# EAGLE design ACSN v2a (EAGLE 9.6.2)
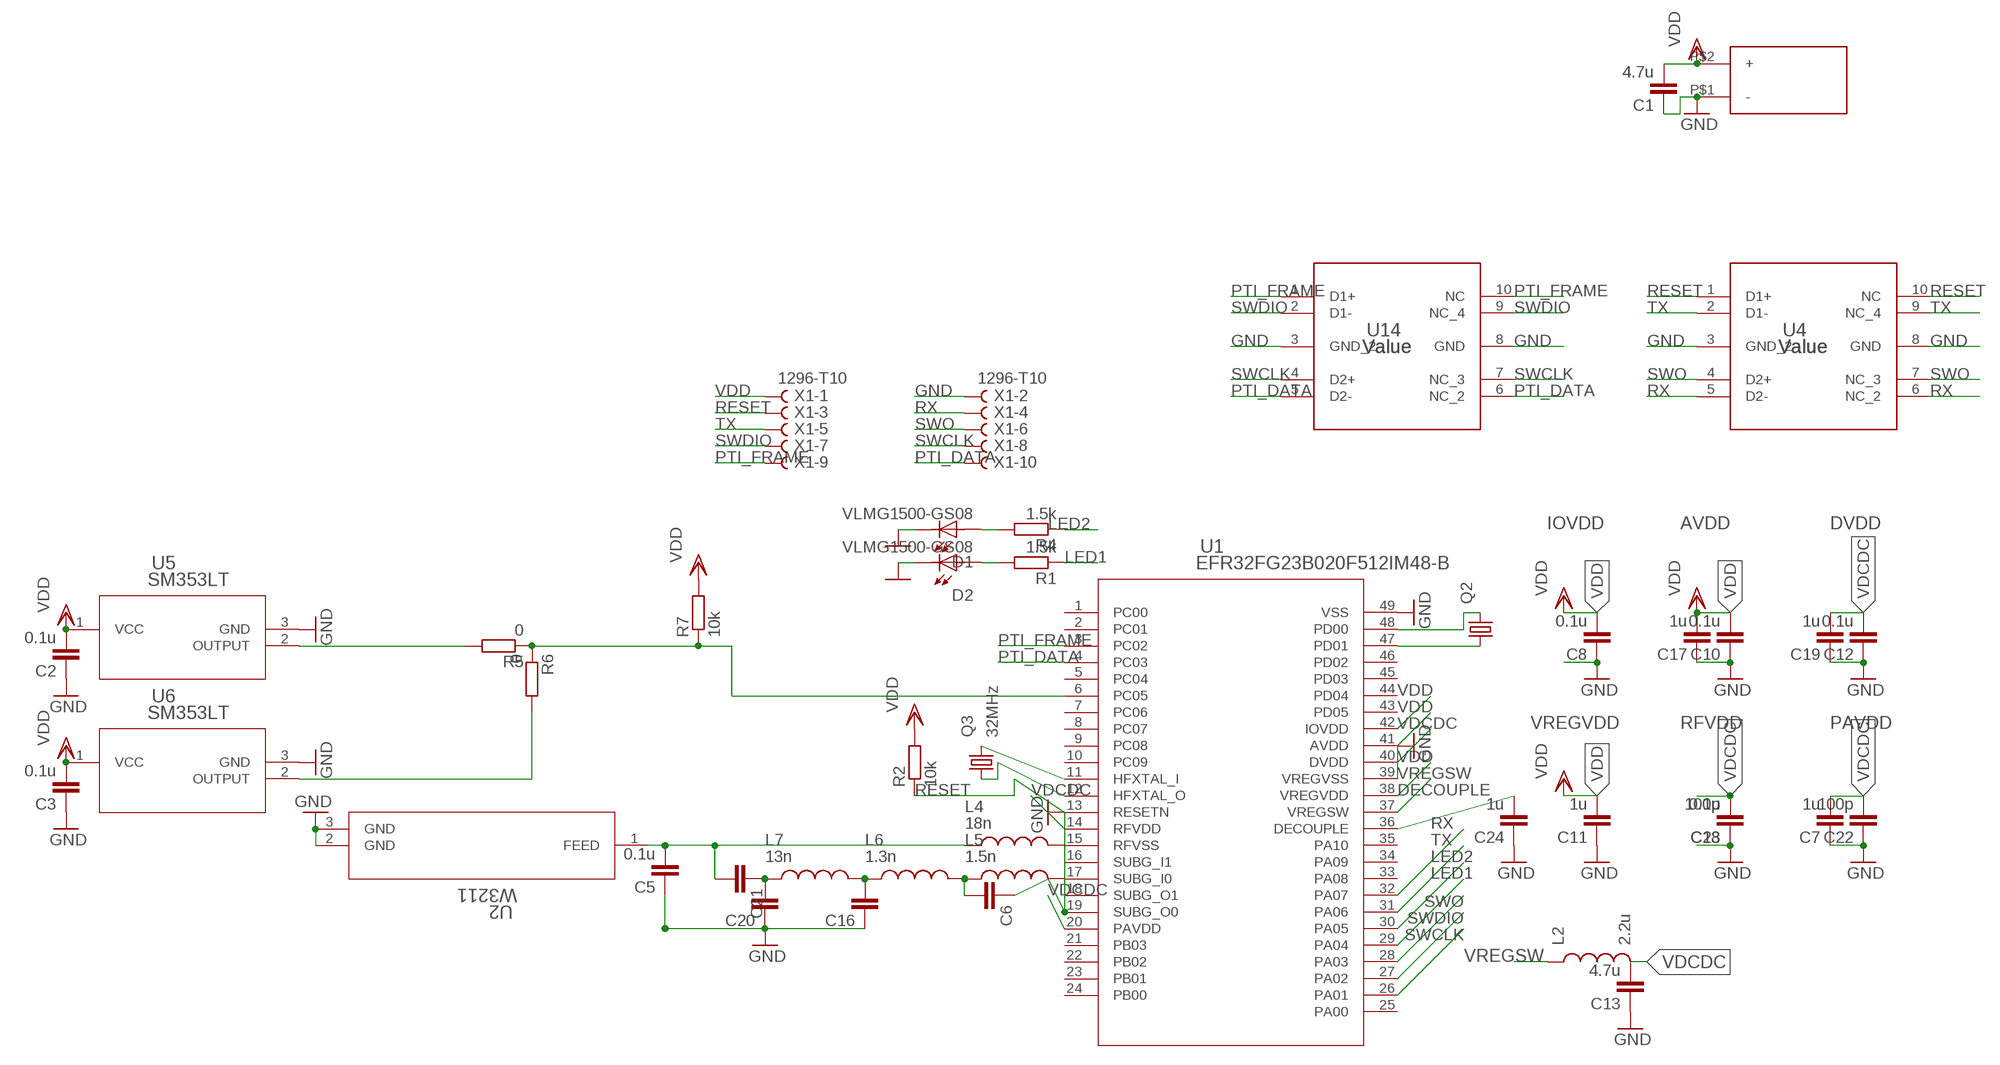
[diagram p0: schematic, sheet 1]

## Parts
C1  4.7u  CC0603R  [C0603R]
C2  0.1u  CC0402  [C0402]
C3  0.1u  CC0402  [C0402]
C5  0.1u  CC0402  [C0402]
C6  1.9p  CC0402  [C0402]
C7  1u  CC0402  [C0402]
C8  0.1u  CC0402  [C0402]
C10  0.1u  CC0402  [C0402]
C11  1u  CC0402  [C0402]
C12  0.1u  CC0402  [C0402]
C13  4.7u  CC0603R  [C0603R]
C16  7.2p  CC0402  [C0402]
C17  1u  CC0402  [C0402]
C18  0.1u  CC0402  [C0402]
C19  1u  CC0402  [C0402]
C20  1.3p  CC0402  [C0402]
C21  220p  CC0402  [C0402]
C22  100p  CC0402  [C0402]
C23  100p  CC0402  [C0402]
C24  1u  CC0402  [C0402]
D1  VLMG1500-GS08  [LEDC1005X35N]
D2  VLMG1500-GS08  [LEDC1005X35N]
L2  2.2u  INDUCTOR  [L0603]
L4  18n  MHQ0402P7N5JT000  [INDC0402X26N]
L5  1.5n  MHQ0402P7N5JT000  [INDC0402X26N]
L6  1.3n  MHQ0402P7N5JT000  [INDC0402X26N]
L7  13n  MHQ0402P7N5JT000  [INDC0402X26N]
Q2  KX-327-RT  [2.0X1.2]
Q3  32MHz  KX-5  [2.0X1.6_KX-5]
R1  1.5k  RR0402  [R0402]
R2  10k  RR0402  [R0402]
R4  1.5k  RR0402  [R0402]
R5  0  RR0402  [R0402]
R6  0  RR0402  [R0402]
R7  10k  RR0402  [R0402]
U1  EFR32FG23B020F512IM48-B  [QFN_48_SIL]
U2  W3211  [CHIP_3211_PUL]
U4  Value  ESD204DQAR  [DQA0010A]
U5  SM353LT  [SM353LT_HNW]
U6  SM353LT  [SM353LT_HNW]
U14  Value  ESD204DQAR  [DQA0010A]
U$2  BS-24R  [BS-24]
X1  1296-T10  [1296-10]

## Nets
DECOUPLE: C24.2 U1.36(DECOUPLE)
GND: C1.1 C2.1 C3.1 C5.1 C7.1 C8.1 C10.1 C11.1 C12.1 C13.1 C16.1 C17.1 C18.1 C19.1 C20.1 C22.1 C23.1 C24.1 D1.2 D2.2 U1.15(RFVSS) U1.39(VREGVSS) U1.49(VSS) U2.2(GND) U2.3(GND) U4.3(GND_2) U4.8(GND) U5.3(GND) U6.3(GND) U14.3(GND_2) U14.8(GND) U$2.P$1(-) X1.2
LED1: R1.1 U1.29(PA04)
LED2: R4.1 U1.30(PA05)
N$1: D2.1 R1.2
N$4: R5.1 R6.1 R7.1 U1.6(PC05)
N$5: C5.2 C21.2 L4.1 U2.1(FEED)
N$6: C6.1 L5.2 U1.19(SUBG_O0)
N$7: D1.1 R4.2
N$8: R5.2 U5.2(OUTPUT)
N$9: R6.2 U6.2(OUTPUT)
N$16: Q3.3 U1.11(HFXTAL_I)
N$17: Q3.1 U1.12(HFXTAL_O)
N$18: Q2.1 U1.47(PD01)
N$19: Q2.2 U1.48(PD00)
N$20: L4.2 U1.17(SUBG_I0)
N$22: C6.2 L5.1 L6.2
N$23: C16.2 L6.1 L7.2
N$24: C20.2 C21.1 L7.1
PTI_DATA: U1.4(PC03) U14.5(D2-) U14.6(NC_2) X1.10
PTI_FRAME: U1.3(PC02) U14.1(D1+) U14.10(NC) X1.9
RESET: R2.1 U1.13(RESETN) U4.1(D1+) U4.10(NC) X1.3
RX: U1.32(PA07) U4.5(D2-) U4.6(NC_2) X1.4
SWCLK: U1.26(PA01) U14.4(D2+) U14.7(NC_3) X1.8
SWDIO: U1.27(PA02) U14.2(D1-) U14.9(NC_4) X1.7
SWO: U1.28(PA03) U4.4(D2+) U4.7(NC_3) X1.6
TX: U1.31(PA06) U4.2(D1-) U4.9(NC_4) X1.5
VDCDC: C7.2 C12.2 C13.2 C18.2 C19.2 C22.2 C23.2 L2.2 U1.14(RFVDD) U1.20(PAVDD) U1.40(DVDD)
VDD: C1.2 C2.2 C3.2 C8.2 C10.2 C11.2 C17.2 R2.2 R7.2 U1.38(VREGVDD) U1.41(AVDD) U1.42(IOVDD) U5.1(VCC) U6.1(VCC) U$2.P$2(+) X1.1
VREGSW: L2.1 U1.37(VREGSW)
Unconnected: U1.1(PC00) U1.2(PC01) U1.5(PC04) U1.7(PC06) U1.8(PC07) U1.9(PC08) U1.10(PC09) U1.16(SUBG_I1) U1.18(SUBG_O1) U1.21(PB03) U1.22(PB02) U1.23(PB01) U1.24(PB00) U1.25(PA00) U1.33(PA08) U1.34(PA09) U1.35(PA10) U1.43(PD05) U1.44(PD04) U1.45(PD03) U1.46(PD02)

## Notes on the sheet
- IOVDD | AVDD | DVDD
- VREGVDD | RFVDD | PAVDD

## Library data of the parts
C1 C13 = eagle-ltspice:C: CAPACITOR, European symbol
C2 C3 C5-C8 C10-C12 C16-C24 = eagle-ltspice:C: CAPACITOR, European symbol; SPICEMODEL: NONE; SPICEPREFIX: C
D1 D2 = VLMG1500-GS08:VLMG1500-GS08: 0402 GREEN 571nm 35MCD 65° Rectangle with Flat Top SMT LED; AVAILABILITY: Unavailable; DESCRIPTION: 0402 GREEN 571nm 35MCD 65° Rectangle with Flat Top SMT LED; MF: Vishay; MP: VLMG1500-GS08; PACKAGE: 0402 Vishay; PRICE: None
L2 = BeagleBone_Blue_R3:INDUCTOR: Inductors Basic Inductor/Choke - 0603 and 1206. Footprints are not proven and vary greatly between part numbers. SRN6045- 33uH, 20% 1.4A
L4-L7 = MHQ0402P7N5JT000:MHQ0402P7N5JT000: 221 NH 5% GOLD TERMINAL; AVAILABILITY: Unavailable; DESCRIPTION: FIXED IND 7.5NH 200MA 1.2 OHM; MF: TDK; MP: MHQ0402P7N5JT000; PACKAGE: 0402 TDK; PRICE: None
Q2 = crystal-geyer_V1_0:KX-327: Tuning Fork Crystals (kHz) SMD: KX327 - Serie Model Size l/w/h [mm] Frequency Range Frequency Stability Temp. Range [°C] Load Capacitance AECQ 200 availabel Datasheet KX-327VT KX-327FT KX-327RT KX-327NHT KX-327NHF KX-327L KX-327S 1.25/1.05/0.5 1.6/1.0/0.5 2.0/1.2/0.6 3.2/1.5/0.8 3.2/1.5/0.8 7.0/1.5/1.4 8.2/3.8/2.5 32,768 kHz 32,768 kHz 32,768 kHz 32,768 kHz 32,768 kHz 32,768 kHz 32,768 kHz ±10 … ±20ppm ±10 … ±20ppm ±10 … ±20ppm ±10 … ±20ppm ±10 … ±20ppm ±10 … ±20ppm ±5 … ±20ppm (*) -40°C …+85°C (*) -40°C …+85°C (*) -40°C …+85°C (*) -40°C …+85°C (*) -40°C …+125°C (*) -40°C …+85°C (*) -40°C …+85°C 7/9/12,5 7/9/12,5 7/9/12,6 7/9/12,5 9/12,5 7/9/12,5 6/12,5 - - - - yes - - KX-327VT.pdf <http://www.geyer-electronic.de/uploads/tx_userartikelfrequenz/GEYER-KX-327VT.pdf> KX-327FT.pdf <http://www.geyer-electronic.de/uploads/tx_userartikelfrequenz/GEYER-KX-327FT.pdf> KX-327RT.pdf <http://www.geyer-electronic.de/uploads/tx_userartikelfrequenz/GEYER-KX-327RT.pdf> KX-327NHT.pdf <http://www.geyer-electronic.de/uploads/tx_userartikelfrequenz/GEYER-KX-327NHT.pdf> KX-327NHF.pdf <http://www.geyer-electronic.de/uploads/tx_userartikelfrequenz/GEYER-KX-327NHF.pdf> KX-327L.pdf <http://www.geyer-electronic.de/uploads/tx_userartikelfrequenz/GEYER-KX-327L.pdf> KX-327S.pdf <http://www.geyer-electronic.de/uploads/tx_userartikelfrequenz/GEYER-KX-327S.pdf> <http://www.geyer-electronic.de/fileadmin/template/img/logo-geyer-electronic.png> Details see: http://www.geyer-electronic.de/Frequenz-Produkte.9.0.html Created 2016-06-07, Hans Locher 2016 (C) Geyer Quartz Technology KX327VT,KX327FT,KX327RT,KX327NHT,KX327NHF,KX327S,KX327L;125105;1610;2012;3215;7015;8238;1,25x1,05,1.25x1.05;1,6x1,0,1.6x1.0;2,0x1,2,2.0x1.2;3,2x1,5,3.2x1.5;8,2x3,8,8.2x3.8,7.0x1.5,7,0x1,532.768kHz
Q3 = crystal-geyer_V1_0:KX: Quartz Crystals (MHz) SMD: KX - Serie Model Size l/w/h [mm] Frequency Range Frequency Stability Temp. Range [°C] Load Capacitance AECQ 200 availabel Datasheet KX-4 KX-5 KX-6 KX-7 KX-9A KX-9B KX-12A KX-12B KX-13 KX-20 KX-K KX-KS 1.6/1.2/0.3 2.0/1.6/0.45 2.5/2.0/0.55 3.2/2.5/0.8 5.0/3.2/1.0 5.0/3.2/1.1 6.0/3.5/1.1 6.0/3.5/1.0 7.0/5.0 /1.3 11.6/5.5/1.6 12.3/4.5/4.2 12.3/4.5/3.2 24.0 ~ 80.0 MHz 16.0 ~ 80.0 MHz 12.0 ~ 80.0 MHz 8.0 ~ 60.0 MHz 7,68 ~ 300,0 MHz 8,0 ~ 50,0 MHz 8,0 ~ 150,0 MHz 8,0 ~ 50,0 MHz 6,0 ~ 160,0 MHz 3,579 ~ 25,0 MHz 3,579 ~ 70,0 MHz 3,579 ~ 70,0 MHz ±10 … ±50ppm ±10 … ±50ppm ±10 … ±50ppm ±10 … ±50ppm ±10 … ±50ppm ±10 … ±50ppm ±10 … ±50ppm ±10 … ±50ppm ±10 … ±50ppm ±50ppm ±10 … ±50ppm ±10 … ±50ppm (*) -40°C …+85°C (*) -40°C …+125°C (*) -40°C …+125°C (*) -40°C …+125°C (*) -40°C …+105°C (*) -40°C …+105°C (*) -40°C …+125°C (*) -40°C …+105°C (*) -40°C …+105°C (*) -40°C …+105°C (*) -40°C …+85°C (*) -40°C …+85°C 8, 8…16 8, 8…16 10, 8…16 12, 7…20 16, 10…20 16, 10…20 16, 10…20 16, 12…20 16, 12…20 16, 12…20 16, 12…30 16, 12…30 - yes yes yes - - - - - - - - KX-4.pdf <http://www.geyer-electronic.de/uploads/tx_userartikelfrequenz/GEYER-KX-4.pdf> KX-5.pdf <http://www.geyer-electronic.de/uploads/tx_userartikelfrequenz/GEYER-KX-5.pdf> KX-6.pdf <http://www.geyer-electronic.de/uploads/tx_userartikelfrequenz/GEYER-KX-6.pdf> KX-7.pdf <http://www.geyer-electronic.de/uploads/tx_userartikelfrequenz/GEYER-KX-7.pdf> KX-9A.pdf <http://www.geyer-electronic.de/uploads/tx_userartikelfrequenz/GEYER-KX-9A.pdf> KX-9B.pdf <http://www.geyer-electronic.de/uploads/tx_userartikelfrequenz/GEYER-KX-9B.pdf> KX-12A.pdf <http://www.geyer-electronic.de/uploads/tx_userartikelfrequenz/GEYER-KX-12A.pdf> KX-12B.pdf <http://www.geyer-electronic.de/uploads/tx_userartikelfrequenz/GEYER-KX-12B.pdf> KX-13.pdf <http://www.geyer-electronic.de/uploads/tx_userartikelfrequenz/GEYER-KX-13.pdf> KX-20.pdf <http://www.geyer-electronic.de/uploads/tx_userartikelfrequenz/GEYER-KX-20.pdf> KX-K.pdf <http://www.geyer-electronic.de/uploads/tx_userartikelfrequenz/GEYER-KX-K.pdf> KX-KS.pdf <http://www.geyer-electronic.de/uploads/tx_userartikelfrequenz/GEYER-KX-KS.pdf> <http://www.geyer-electronic.de/fileadmin/template/img/logo-geyer-electronic.png> Details see: http://www.geyer-electronic.de/Frequenz-Produkte.9.0.html Created 2016-06-07, Hans Locher 2016 (C) Geyer Quartz Technology KX4,KX5,KX6,KX7,KX9A,KX9B,KX12A,KX12B,KX13,KX20,KXK,KXKS;1612;2016;2520;3225;5032;6035;7050;11655;12345;1,6x1,2;2,0x1,6;2,5x2,0;3,2x2,5;5,0x3,2;6,0x3,5;7,0x5,0;11,6x5,5;12,3x4,5;12,3x4,5;1.6x1.2;2.0x1.6;2.5x2.0;3.2x2.5;5.0x3.2;6.0x3.5;7.0x5.0;11.6x5.5;12.3x4.5;12.3x4.5;
R1 R2 R4-R7 = eagle-ltspice:R: RESISTOR, European symbol; SPICEMODEL: NONE; SPICEPREFIX: R
U1 = EFR32FG23B020F512IM48:EFR32FG23B020F512IM48-B; COPYRIGHT: Copyright (C) 2022 Ultra Librarian. All rights reserved.; MANUFACTURER_PART_NUMBER: EFR32FG23B020F512IM48-B; MFR_NAME: Silicon Labs
U2 = W3211:W3211; COPYRIGHT: Copyright (C) 2022 Ultra Librarian. All rights reserved.; MANUFACTURER_PART_NUMBER: W3211; MFR_NAME: Pulse Electronics Corporation
U4 U14 = ESD204DQAR:ESD204DQAR; MANUFACTURER: Texas Instruments; PARTNUMBER: ESD204DQAR; REFDES: RefDes; TYPE: TYPE
U5 U6 = SM353LT:SM353LT; COPYRIGHT: Copyright (C) 2022 Ultra Librarian. All rights reserved.; MANUFACTURER_PART_NUMBER: SM353LT; MFR_NAME: Honeywell
U$2 = BS-24:BS-24R
X1 = con-leotronics:1296-T10: 1.27mm SINGLE ROW FEMALE SOCKET Source: http://www.leotronics.co.uk/Conexcon/Data%20Sheets/sec.%20A/1296ing.pdf; OC_FARNELL: unknown; OC_NEWARK: unknown

## Board
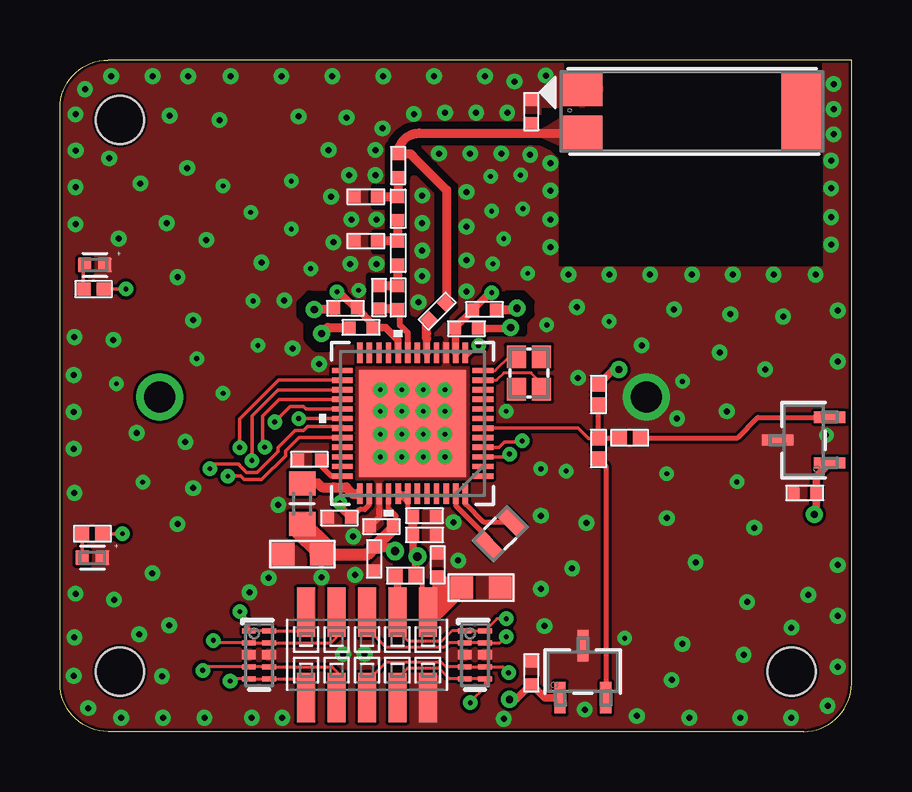
[diagram p1: board, top side]
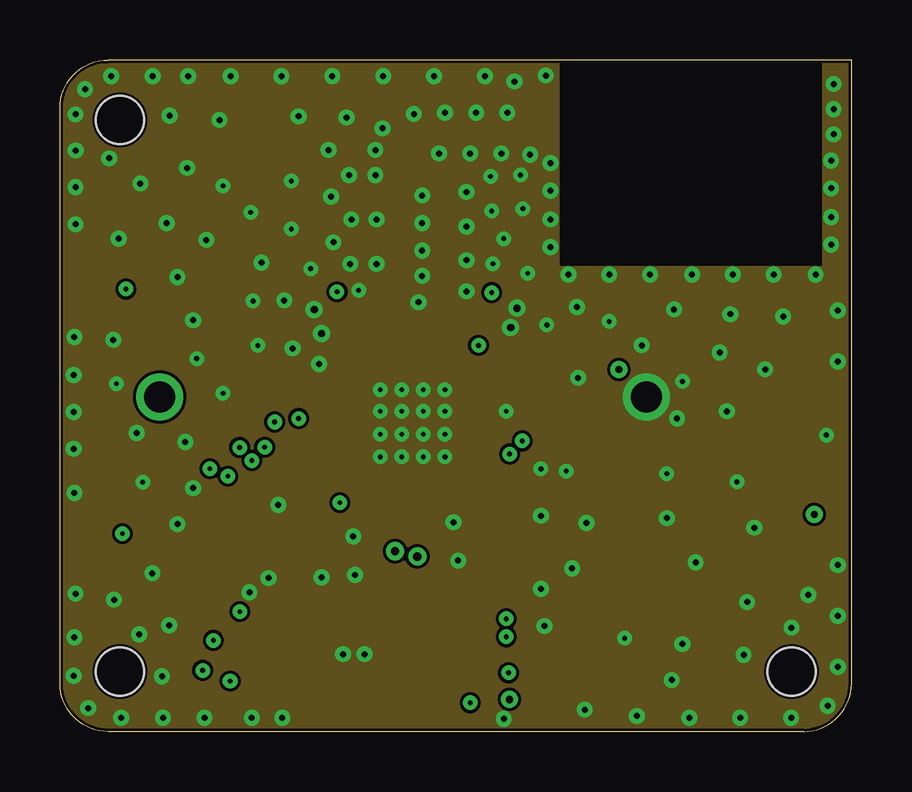
[diagram p2: board, inner layer Route2]
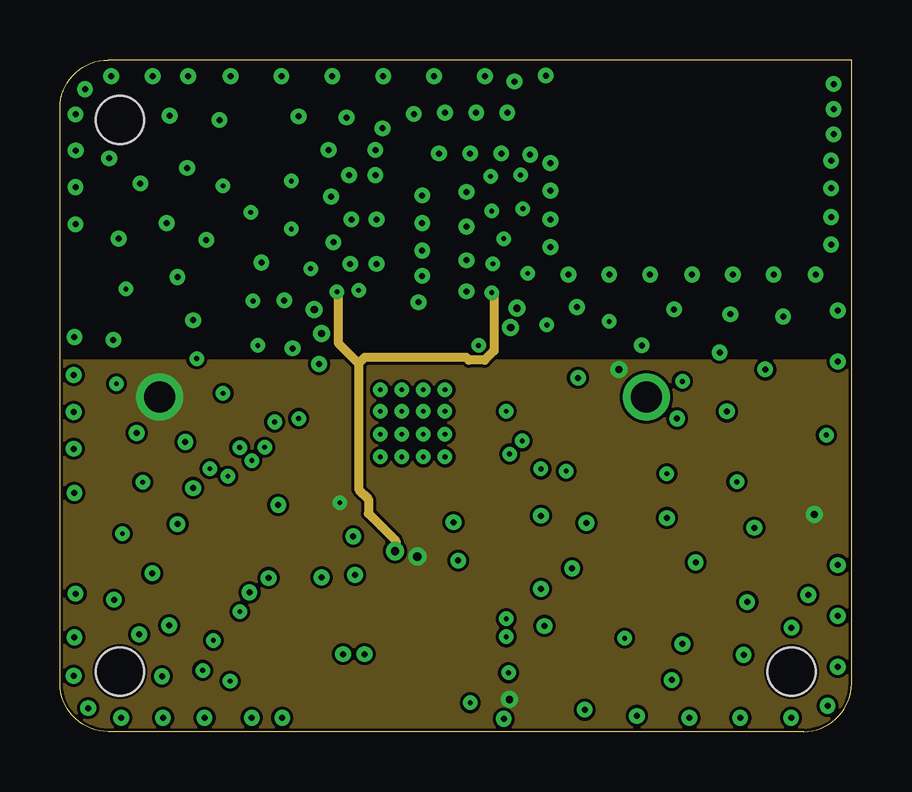
[diagram p3: board, inner layer Route15]
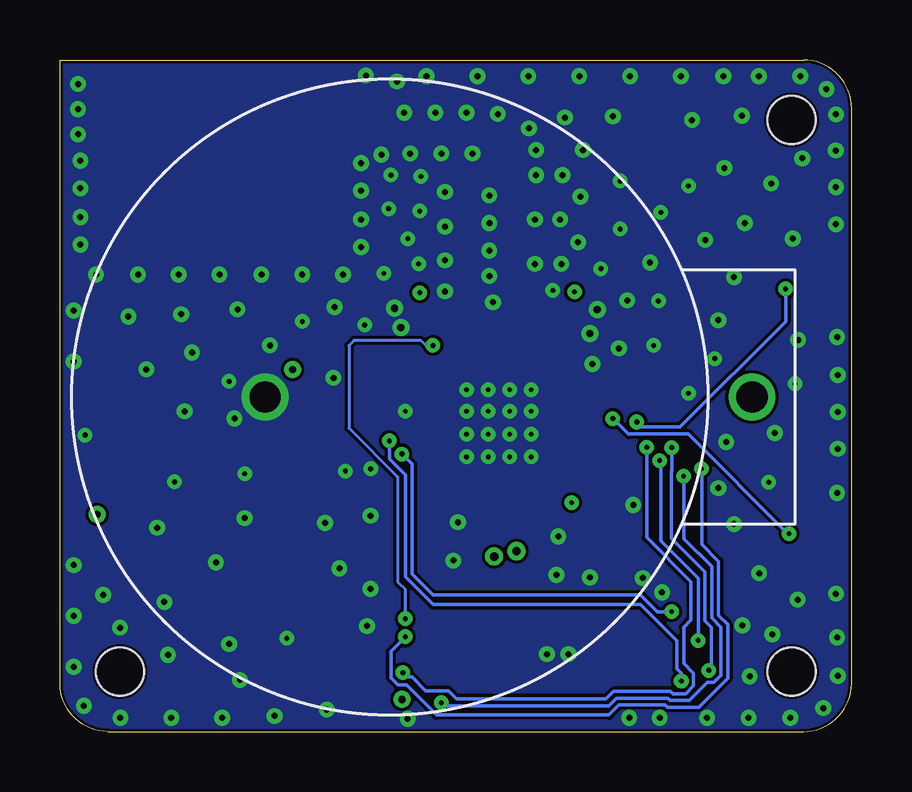
[diagram p4: board, bottom side, seen from below]

Size 33 x 28 mm. Coordinates in mm from the lower left corner, seen from the top.
Outline: 33,2 33,28 2,28 arc90 0,26 0,2 arc90 2,0 31,0 arc90 33,2
Copper layers (1+2*15+16): Top 0.035mm / dielectric 0.51mm / Route2 0.035mm / dielectric 0.15mm / Route15 0.035mm / dielectric 0.2mm / Bottom 0.035mm
Design rules "default *": minimum track width 5mil, minimum drill 0.2mm, track to track 5mil, track to pad 5mil, pad to pad 5mil, via to via 5mil, smd to smd 5mil, copper to edge 5mil, drill to drill 6mil, minimum pad ring 10mil, minimum via ring 8mil, stop-mask expansion 0mil, vias tented up to drill 40mil, thermal gap 0mil
Holes 2 mm at 2.5,2.5 30.5,2.5 2.5,25.5
tRestrict: area 10.1,16 to 12.5,18.2; area 16.8,16.6 to 19.6,18.2; 40 lines

### Footprints (pad centres in the part's own frame; a part is rotated, then mirrored left to right if it is on the bottom)
C0603R = smd 0.95 x 0.95: 1 -0.85,0; 2 0.75,0
C0402 = smd 0.5 x 0.5: 1 -0.475,0; 2 0.475,0
LEDC1005X35N = smd 0.59 x 0.61: 1 -0.415,0; 2 0.415,0
L0603 = smd 1 x 1.1: 1 -0.85,0; 2 0.85,0
INDC0402X26N = smd 0.5 x 0.5: 1 -0.732,0; 2 0.232,0
2.0X1.2 = smd 0.6 x 1.1: 1 -0.7,0; 2 0.7,0
2.0X1.6_KX-5 = smd 0.95 x 0.8: 1 -0.675,-0.525; 2 0.675,-0.525; 3 0.675,0.525; 4 -0.675,0.525
R0402 = smd 0.6 x 0.55: 1 -0.425,0; 2 0.425,0
QFN_48_SIL = smd 0.86 x 0.22: 1 -2.935,2.2; 2 -2.935,1.8; 3 -2.935,1.4; 4 -2.935,1; 5 -2.935,0.6; 6 -2.935,0.2; 7 -2.935,-0.2; 8 -2.935,-0.6; 9 -2.935,-1; 10 -2.935,-1.4; 11 -2.935,-1.8; 12 -2.935,-2.2; 25 2.935,-2.2; 26 2.935,-1.8; 27 2.935,-1.4; 28 2.935,-1; 29 2.935,-0.6; 30 2.935,-0.2; 31 2.935,0.2; 32 2.935,0.6; 33 2.935,1; 34 2.935,1.4; 35 2.935,1.8; 36 2.935,2.2 | smd 0.22 x 0.86: 13 -2.2,-2.935; 14 -1.8,-2.935; 15 -1.4,-2.935; 16 -1,-2.935; 17 -0.6,-2.935; 18 -0.2,-2.935; 19 0.2,-2.935; 20 0.6,-2.935; 21 1,-2.935; 22 1.4,-2.935; 23 1.8,-2.935; 24 2.2,-2.935; 37 2.2,2.935; 38 1.8,2.935; 39 1.4,2.935; 40 1,2.935; 41 0.6,2.935; 42 0.2,2.935; 43 -0.2,2.935; 44 -0.6,2.935; 45 -1,2.935; 46 -1.4,2.935; 47 -1.8,2.935; 48 -2.2,2.935 | smd 4.45 x 4.45: 49 0,0
CHIP_3211_PUL = smd 1.7 x 1.45: 1 -4.277,-0.9; 3 -4.277,0.95 | smd 1.7 x 3.2: 2 4.877,0
DQA0010A = smd 0.565 x 0.2: 1 -0.417,1; 2 -0.417,0.5; 4 -0.417,-0.5; 5 -0.417,-1; 6 0.417,-1; 7 0.417,-0.5; 9 0.417,0.5; 10 0.417,1 | smd 0.565 x 0.4: 3 -0.417,0; 8 0.417,0
SM353LT_HNW = smd 0.466 x 1.31: 1 -0.953,-1.092; 2 0.953,-1.092; 3 0,1.092
BS-24 = drill 1.3: P$1 0,0; P$2 20.3,0
1296-10 = smd 0.76 x 2.05: 1 -2.54,-1.78; 2 -2.54,1.78; 3 -1.27,-1.78; 4 -1.27,1.78; 5 0,-1.78; 6 0,1.78; 7 1.27,-1.78; 8 1.27,1.78; 9 2.54,-1.78; 10 2.54,1.78

### Placement (x,y rotation side)
C1  17.5,6 180 top
C2  31.05,9.95 0 top
C3  19.65,2.45 270 top
C5  19.65,25.85 270 top
C6  13.3,18.1 90 top
C7  13.1,7.2 90 top
C8  15.75,6.95 270 top
C10  15.2,8.2 180 top
C11  11.65,8.9 0 top
C12  17.7,17.6 180 top
C13  10.15,7.4 0 top
C16  12.75,20.45 0 top
C17  15.2,9 180 top
C18  11.9,17.65 0 top
C19  13.4,8.55 0 top
C20  12.75,22.3 0 top
C21  14.1,23.6 90 top
C22  12.55,16.85 0 top
C23  16.95,16.8 180 top
C24  10.4,11.35 0 top
D1  1.35,7.25 0 top
D2  1.45,19.45 0 top
L2  10.1,9.5 270 top
L4  15.55,17.35 225 top
L5  14.1,17.85 270 top
L6  14.1,19.7 270 top
L7  14.1,21.55 270 top
Q2  18.35,8.25 45 top
Q3  19.55,14.95 270 top
R1  1.4,18.45 180 top
R2  14.4,6.5 0 top
R4  1.35,8.25 180 top
R5  22.45,11.8 270 top
R6  23.75,12.25 0 top
R7  22.45,14.05 90 top
U1  14.7,12.85 180 top
U2  26.05,25.85 0 top
U4  17.3,3.2 0 top
U5  21.8,2.5 0 top
U6  31,12.15 90 top
U14  8.3,3.2 0 top
U$2  24.45,13.95 0 bottom
X1  12.8,3.2 180 top

### Tracks (layer width: path | path; a pad name or v marks a point on that pad's centre or on a via)
DECOUPLE
  Top 0.203: 10.88,11.29 C24.2 10.91,11.32 10.91,11.04 11.3,10.65 U1.36
GND  (via drill 0.2, 0.25, 0.3)
  Top 0.15: 14.8,12.4 14.7,12.5 14.65,12.35
  Top 0.254: U1.39 13.3,8.93 C19.1
  Top 0.305: C23.1 18.74,16.8 v18.79,16.85
  Top 0.368: 11.43,17.5 C18.1 11.38,17.6 v10.6,17.6 | 18.17,17.55 C12.1 19.05,17.6 v19.05,17.65 | 12.01,16.78 C22.1 11.16,16.85 v10.91,16.6
  other vias: 20.45,23.7 15.1,20.05 15.1,19 14.95,17.9 20.25,27.35 16.95,18.35 11.4,20.4 11.3,22.3 15.1,21.2 15.1,22.35 32.15,21.45 32.15,22.65 32.15,23.8 32.15,20.3 31.5,19.05 29.75,19.05 28.05,19.05 26.35,19.05 24.6,19.05 22.9,19.05 21.2,19.05 20.45,20.2 20.45,21.35 20.45,22.55 32.25,24.9 32.25,25.95 32.25,27 25.3,10.75 31.95,12.36 21.1,10.86 28.22,10.41 23.54,3.89 20.05,10.95 25.95,14.6 2.35,14.5 22.9,17.1 18.05,19.5 19.2,23.2 19.3,21.8 17.95,23.15 18,21.7 18.5,20.55 12.45,18.4 31.2,5.7 28.65,5.4 28.5,3.2 20.2,4.4 25.5,2.15 25.95,3.65 26.5,7.05 28.95,8.5 24.05,0.65 21.95,8.7 27.95,17.4 5.3,23.5 27.8,13.35 25.3,8.9 20.05,9 21.35,6.8 16.95,22.5 16.95,21.05 16.95,19.65 5.55,17.15 21.55,17.7 21.6,14.75 24.25,16.1 25.6,17.6 12.15,21.35 13.2,21.35 29.4,15.1 30.15,17.3 15.8,24.1 13.15,24.25 12.05,23.2 14.75,25.75 13.45,25.15 13.15,23.2 11.95,25.6 11.2,24.25 9.95,25.65 6.65,25.5 16.05,25.8 12.1,19.5 4.45,21.2 13.2,19.5 3.35,22.85 0.65,22.7 0.65,21.15 2.05,23.9 2.45,20.55 4.9,18.95 0.65,5.75 3.3,4.05 4.9,8.65 3.85,6.6 3.2,12.45 8.7,6.4 2.25,5.5 4.25,2.3 5.55,10.15 9.1,9.45 0.6,9.95 0.6,16.45 27.5,15.8 32.43,2.7 32.43,4.82 32.43,6.94 21.88,0.91 12.23,8.13 25.73,13.06 32.43,15.43 32.43,17.55 0.58,13.32 0.58,11.79 5.23,12.07 0.58,14.86 2.23,16.33 0.66,24.23 17.72,27.33 15.6,27.33 13.47,27.33 11.35,27.33 9.23,27.33 7.11,27.33 5.34,27.33 4.57,25.68 1.05,26.78 3.86,27.33 2.14,27.33 0.65,25.73 30.5,4.33 32,1.08 30.48,0.58 28.36,0.58 26.24,0.58 18.5,0.53 9.27,0.58 8,0.58 6.02,0.58 2.55,0.58 1.18,0.98 4.3,0.58 0.58,2.33 0.6,3.93 7.9,5.8 4.55,4.43 18.65,25.8 17.35,25.8 18.95,27.1 17.1,24.1 18.4,24.1 19.6,24.05 8.4,19.55 3.45,10.4 19.5,19.1 8.05,17.95 20.3,16.95 18.6,13.35 9.65,20.95 9.65,22.95 7.95,21.65 6.8,22.75 10.45,19.3 6.1,20.5 6.8,14.1 5.7,15.55 8.25,16.1 20.05,5.95 16.05,12.4 15.15,12.4 14.25,12.4 13.35,12.4 13.35,13.35 14.25,13.35 15.15,13.35 16.05,13.35 16.05,14.25 15.15,14.25 14.25,14.25 13.35,14.25 14.25,11.45 13.35,11.45 15.15,11.45 16.05,11.45 11.8,3.23 12.7,3.23 12.3,6.53 10.9,6.43 16.6,7.13 16.4,8.73 10.8,15.33 9.7,15.98 9.35,17.98
  pour Top: 0,28 20.95,28 20.95,27.35 22.6,27.35 22.6,26.05 20,26.05 20,24.6 20.75,23.85 20.75,19.35 31.85,19.35 31.85,24.2 30.15,24.2 30.15,27.3 31.85,27.3 31.85,28 33,28 33,0 0,0
  pour Bottom: 0,28.05 33.1,28.05 33.1,-0.1 0,-0.1
  pour Route2: 0,27.95 20.75,27.95 20.75,19.35 31.85,19.35 31.85,28 33,28 33,0 0,0
LED1  (via drill 0.2)
  Top 0.152: R1.1 v2.75,18.45 | 8.95,12.97 v8.95,12.91 9.6,13.56 10.16,13.56 10.27,13.45 U1.29
  Bottom 0.152: v2.75,18.45 2.75,17.1 7.15,12.7 8.74,12.7 v8.95,12.91
LED2  (via drill 0.2)
  Top 0.152: R4.1 v2.6,8.25 | v9.95,13.05 U1.30
  Bottom 0.152: v2.6,8.25 2.65,8.25 6.8,12.4 9.3,12.4 v9.95,13.05
N$1
  Top 0.152: R1.2 0.98,19.39 D2.1
N$4
  Top 0.152: U1.6 21.6,12.65 22.02,12.22 22.6,12.22
  Top 0.2: R6.1 23.3,12.22 22.6,12.22 R5.1 R7.1
N$5
  Top 0.15: C5.2 19.65,24.95
  Top 0.203: C21.2 arc90 14.12,24.05 14.65,24.05 14.7,24
  Top 0.368: U2.1 19.65,24.95 14.98,24.95 arc90 C21.2 14.62,24.07 14.65,24.05 | L4.1 16.12,17.92 16.12,22.58 14.7,24
  pour Top (rank 2): 20.01,24.82 21.05,24.36 21.05,25.65 20.05,25.06
N$6
  Top 0.254: L5.2 14.17,17.55 14.17,16.95 14.5,16.62 U1.19
  Top 0.368: L5.2 13.31,17.62 C6.1
N$7
  Top 0.152: D1.1 R4.2
N$8
  Top 0.2: R5.2 22.75,11.07 U5.2
N$9
  Top 0.2: R6.2 28.25,12.25 29.1,13.1 U6.2
N$16
  Top 0.127: Q3.3 20.08,14.52 19.64,14.95 18.5,14.95 18.2,14.65 U1.11
N$17
  Top 0.127: U1.12 18.15,15.05 18.72,15.62 Q3.1
N$18
  Top 0.203: U1.47 16.5,9.42 17.85,8.06 Q2.1
N$19
  Top 0.127: 16.91,9.99 U1.48
  Top 0.203: U1.48 16.9,9.48 17.64,8.75 Q2.2
N$20
  Top 0.305: U1.17 15.29,16.33 15.29,16.6
  Top 0.368: L4.2 15.39,17.09 15.29,16.99 15.29,16.6 15.29,16.39
N$22
  Top 0.2: 14.1,19.4 L6.2
  Top 0.368: 14.1,19.4 L5.1 C6.2
N$23
  Top 0.2: L6.1 14.1,20.45 | 14.1,20.45 L7.2 | 13.8,20.45 14.1,20.45
  Top 0.368: C16.2 13.8,20.45 14.08,20.45 L6.1 L7.2
N$24
  Top 0.368: C21.1 L7.1 13.24,22.28 C20.2
PTI_DATA  (via drill 0.2)
  Top 0.127: X1.10 10.35,1.51 10.35,2.05 10.2,2.2 U14.6 U14.5 7.19,2.2 v7.09,2.11
  Top 0.152: U1.4 18.31,11.85 18.53,12.08 19.23,12.08 v19.27,12.12
  Bottom 0.152: v19.27,12.12 19.27,11.37 18.6,10.7 18.6,6.45 17.45,5.3 8.8,5.3 7.28,3.78 7.28,2.61 7.09,2.43 v7.09,2.11
PTI_FRAME  (via drill 0.2)
  Top 0.127: X1.9 10.26,4.26 10.2,4.2 U14.10 U14.1 7.88,4.62 v7.5,5
  Top 0.152: v18.74,11.57 18.62,11.45 U1.3
  Bottom 0.152: v7.5,5 8.1,5 8.8,5.7 17.45,5.7 18.32,6.57 18.32,11.15 v18.74,11.57
RESET  (via drill 0.2)
  Top 0.127: X1.3 14.07,4.23 14.54,3.76 15.91,3.76 16.35,4.2 U4.1 U4.10 18.22,4.7 v18.6,4.7 | U1.13 16.97,15.62 v17.45,16.1
  Top 0.305: X1.3 14.07,6.41 R2.1
  Bottom 0.127: v17.45,16.1 17.75,16.1 17.96,16.31 20.74,16.31 20.95,16.1 20.95,12.65 18.92,10.62 18.92,6.24 18.6,5.92 v18.6,4.7
RX  (via drill 0.2)
  Top 0.127: X1.4 13.9,1.59 13.9,2.05 14.48,2.63 15.8,2.63 16.23,2.2 U4.5 U4.6 17.72,1.85 17.1,1.23 v17.1,1.2
  Top 0.152: U1.32 11.69,12.26 9.96,12.26 9.4,11.7 9.4,11.5 8.41,10.51 7.67,10.51 7.54,10.65 v7,10.65
  Bottom 0.152: v7,10.65 6.98,10.63 6.98,8.03 5.83,6.88 5.83,4.73 5.44,4.35 5.44,2.34 5.74,2.04 6.01,2.04 6.76,1.3 7.57,1.3 7.66,1.39 9.81,1.39 10.12,1.08 16.98,1.08 v17.1,1.2
SWCLK  (via drill 0.2)
  Top 0.127: X1.8 11.55,1.44 11.55,2.5 11.35,2.7 U14.7 U14.4 6.1,2.7 v5.95,2.55
  Top 0.152: v7.49,11.84 7.49,13.04 8.53,14.07 8.6,14.15 9.11,14.65 U1.26
  Bottom 0.152: v5.95,2.55 5.84,2.66 5.84,4.35 6.11,4.62 6.11,6.66 7.51,8.06 7.51,10.86 7.49,10.87 v7.49,11.84
SWDIO  (via drill 0.2)
  Top 0.127: X1.7 11.53,3.93 11.3,3.7 U14.9 U14.2 6.5,3.7 v6.4,3.8
  Top 0.152: v8,11.3 8,13.15 9.1,14.25 U1.27
  Bottom 0.152: v6.4,3.8 6.39,3.81 6.39,6.39 7.95,7.95 7.95,11.25 v8,11.3
SWO  (via drill 0.2)
  Top 0.127: X1.6 12.8,2.1 13.59,2.89 15.9,2.89 16.09,2.7 U4.4 U4.7 18.45,2.7 v18.7,2.45
  Top 0.152: v8.53,11.85 8.44,11.94 8.44,13.16 9.14,13.85 U1.28
  Bottom 0.152: v8.53,11.85 8.53,8.08 6.7,6.25 6.7,4.65 7,4.35 7,2.85 6.59,2.44 6.59,1.9 6.91,1.57 7.45,1.57 7.54,1.67 9.92,1.67 10.23,1.36 16.46,1.36 16.81,1.71 17.76,1.71 18.33,2.27 18.52,2.27 v18.7,2.45
TX  (via drill 0.2)
  Top 0.127: X1.5 12.8,4.3 13.59,3.51 16.02,3.51 16.21,3.7 U4.2 U4.9 18.35,3.7 v18.6,3.95
  Top 0.152: U1.31 11.81,12.71 10.33,12.71 10.16,12.54 9.8,12.54 9.1,11.84 9.1,11.68 8.21,10.79 7.79,10.79 7.49,11.09 7.49,11.11 7.44,11.16 6.45,11.16 v6.25,10.96
  Bottom 0.152: v6.25,10.96 6.25,7.8 5.55,7.1 5.55,4.85 5.16,4.46 5.16,2.23 6.37,1.02 7.68,1.02 7.77,1.11 9.69,1.11 10.11,0.69 17.31,0.69 18.56,1.94 18.91,1.94 19.21,2.24 19.21,3.34 v18.6,3.95
VDCDC  (via drill 0.2, 0.35)
  Top 0.2: C19.2 14.02,8.7 | 17.19,17.56 C12.2 17.34,17.71
  Top 0.203: C22.2 13.15,16.85 | 14.02,8.7 14.02,8.98 13.7,9.3 U1.40
  Top 0.254: U1.20 14.1,15.88 14.11,15.89 14.09,15.91 | C23.2 16.48,16.76 16.46,16.74
  Top 0.305: v11.55,18.33 11.7,18.18 11.79,18.18 12.32,17.65 C18.2 13.02,17 C22.2 | v18,18.3 17.83,18.13 17.75,18.13 17.34,17.71 | 17.19,17.56 16.48,16.85 C23.2 16.48,16.74 | C13.2 10.9,7.3 | U1.14 16.49,15.8 16.49,16.48 16.46,16.51 16.46,16.74 | 14.09,15.91 14.09,16.33 13.57,16.85 13.15,16.85
  Top 0.368: C7.2 13.71,7.67 13.87,7.52 v13.97,7.52
  Top 0.508: C13.2 10.98,7.33 11.23,7.33 11.18,7.38 | 11.18,7.38 12.8,7.38 C7.2 13.88,8.45 C19.2 | 11.18,7.38 10.1,8.45 L2.2
  Top 1.016: C13.2 10.9,7.65 10.1,8.45
  Route15 0.368: v13.97,7.52 14,7.55 14,7.95 12.86,9.09 12.86,9.69 12.45,10.1 12.45,15.35 | v11.55,18.33 11.6,18.28 11.6,16.2 12.45,15.35 | 12.45,15.35 12.7,15.6 16.93,15.6 17.05,15.49 17.7,15.49 18.1,15.88 18.1,18.2 v18,18.3
VDD  (via drill 0.2, 0.3, 0.35)
  Top 0.2: U1.38 12.9,10.08
  Top 0.203: R2.2 15.1,6.22 15.1,5.22 X1.1 | U1.38 12.89,9.9 12.89,9.44 12.7,9.26 12.48,9.26 C11.2 | C17.2 14.5,9.22 14.5,9.55 | 14.5,9.55 U1.42 U1.41 14.14,9.91 14.5,9.55
  Top 0.305: C10.2 14.73,7.47 v14.9,7.3 14.82,7.22 R2.2 | v11.67,9.54 11.67,9.36 C11.2 | U6.1 31.52,10.63 C2.2 31.52,9.12 v31.45,9.05 | U5.1 20.22,1.41 C3.2 19.01,1.33 v18.74,1.33 | R7.2 23.08,15.1 v23.3,15.1
  Top 0.368: C10.2 C17.2
  Top 0.508: 15.75,5.85 C8.2 16.23,6 C1.2 | 15.6,4.98 15.7,5.08 15.7,5.85 15.75,5.85 | 16.42,5.67 16.25,5.85 15.75,5.85
  Top 0.61: C1.2 16.42,5.67 15.73,4.98 15.6,4.98 X1.1
  pour Route15: 0,-0.05 33.05,-0.05 33.05,15.45 0,15.45
VREGSW
  Top 0.254: 12.2,9.91 U1.37
  Top 0.406: L2.1 10.75,10.35 10.92,10.18 11.41,10.18 | 11.41,10.18 11.93,10.18 12.2,9.91 12.41,9.91 | 11.41,10.18

### Text on the board
tStop: ACSN | v2.0a